# Altium schematic sheet top_for_ppt.SchDoc
size A
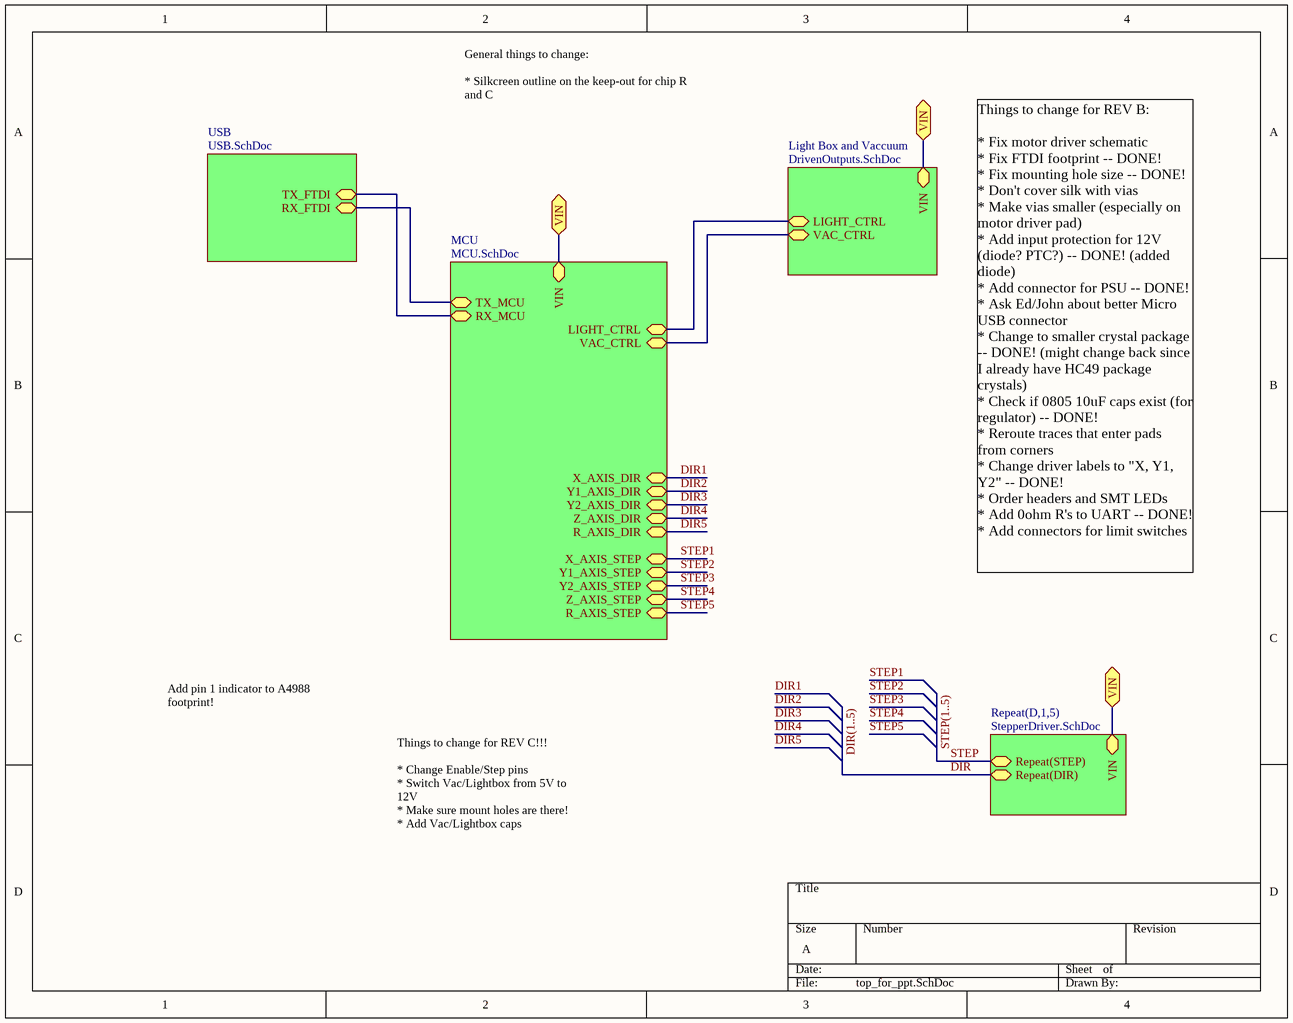
[diagram p0: top_for_ppt.SchDoc]

## Sub-sheets
Light Box and Vaccuum = DrivenOutputs.SchDoc: LIGHT_CTRL, VAC_CTRL, VIN
MCU = MCU.SchDoc: VAC_CTRL, TX_MCU, RX_MCU, X_AXIS_STEP, Y2_AXIS_STEP, X_AXIS_DIR, Y2_AXIS_DIR, Z_AXIS_DIR, Y1_AXIS_DIR, Y1_AXIS_STEP, LIGHT_CTRL, VIN, R_AXIS_DIR, Z_AXIS_STEP, R_AXIS_STEP
Repeat(D,1,5) = StepperDriver.SchDoc: Repeat(STEP), Repeat(DIR), VIN
USB = USB.SchDoc: TX_FTDI, RX_FTDI

## Ports
VIN

## Nets
DIR: sheet Repeat(D,1,5)/Repeat(DIR)
DIR1: sheet MCU/X_AXIS_DIR
DIR2: sheet MCU/Y1_AXIS_DIR
DIR3: sheet MCU/Y2_AXIS_DIR
DIR4: sheet MCU/Z_AXIS_DIR
DIR5: sheet MCU/R_AXIS_DIR
STEP: sheet Repeat(D,1,5)/Repeat(STEP)
STEP1: sheet MCU/X_AXIS_STEP
STEP2: sheet MCU/Y1_AXIS_STEP
STEP3: sheet MCU/Y2_AXIS_STEP
STEP4: sheet MCU/Z_AXIS_STEP
STEP5: sheet MCU/R_AXIS_STEP
VIN: port VIN, sheet MCU/VIN, sheet Light Box and Vaccuum/VIN, sheet Repeat(D,1,5)/VIN
(unnamed): sheet MCU/VAC_CTRL, sheet Light Box and Vaccuum/VAC_CTRL
(unnamed): sheet MCU/TX_MCU, sheet USB/RX_FTDI
(unnamed): sheet MCU/RX_MCU, sheet USB/TX_FTDI
(unnamed): sheet MCU/LIGHT_CTRL, sheet Light Box and Vaccuum/LIGHT_CTRL

## Buses and harness runs
bus DIR(1..5)
bus STEP(1..5)

## Notes on the sheet
- General things to change:
  * Silkcreen outline on the keep-out for chip R and C
- Things to change for REV B:
  * Fix motor driver schematic
  * Fix FTDI footprint -- DONE!
  * Fix mounting hole size -- DONE!
  * Don't cover silk with vias
  * Make vias smaller (especially on motor driver pad)
  * Add input protection for 12V (diode? PTC?) -- DONE! (added diode)
  * Add connector for PSU -- DONE!
  * Ask Ed/John about better Micro USB connector
  * Change to smaller crystal package -- DONE! (might change back since I already have HC49 package crystals)
  * Check if 0805 10uF caps exist (for regulator) -- DONE!
  * Reroute traces that enter pads from corners
  * Change driver labels to "X, Y1, Y2" -- DONE!
  * Order headers and SMT LEDs
  * Add 0ohm R's to UART -- DONE!
  * Add connectors for limit switches
- Add pin 1 indicator to A4988 footprint!
- Things to change for REV C!!!
  * Change Enable/Step pins
  * Switch Vac/Lightbox from 5V to 12V
  * Make sure mount holes are there!
  * Add Vac/Lightbox caps